# Altium schematic sheet block.SchDoc
size A4
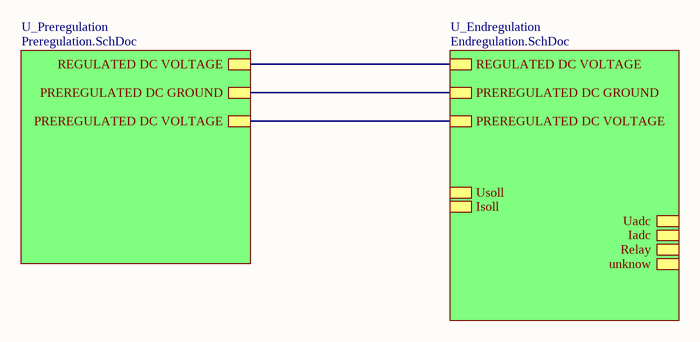
[diagram p0: block.SchDoc]

## Sub-sheets
U_Endregulation = Endregulation.SchDoc: PREREGULATED DC VOLTAGE, Usoll, Isoll, PREREGULATED DC GROUND, Uadc, Iadc, REGULATED DC VOLTAGE, Relay, unknow
U_Preregulation = Preregulation.SchDoc: REGULATED DC VOLTAGE, PREREGULATED DC GROUND, PREREGULATED DC VOLTAGE

## Nets
(unnamed): sheet U_Preregulation/REGULATED DC VOLTAGE, sheet U_Endregulation/REGULATED DC VOLTAGE
(unnamed): sheet U_Preregulation/PREREGULATED DC GROUND, sheet U_Endregulation/PREREGULATED DC GROUND
(unnamed): sheet U_Preregulation/PREREGULATED DC VOLTAGE, sheet U_Endregulation/PREREGULATED DC VOLTAGE